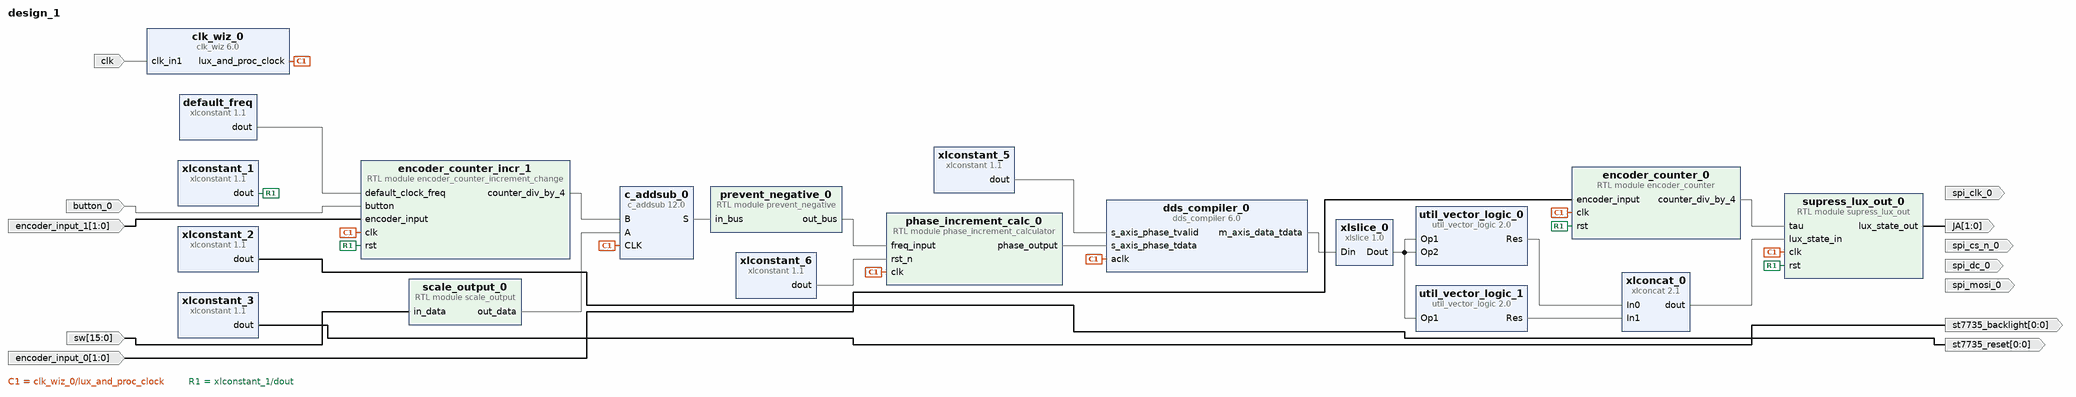
[diagram p0: block diagram of the top level]
# Vivado block design design_1, xc7a35tcpg236-1, Vivado 2023.1
create_bd_design design_1

create_bd_port -dir I -type clk clk
set_property -dict {CONFIG.ASSOCIATED_RESET sw} [get_bd_ports clk]
create_bd_port -dir O -from 1 -to 0 JA
create_bd_port -dir I -from 1 -to 0 encoder_input_0
create_bd_port -dir O -type clk spi_clk_0
create_bd_port -dir O spi_mosi_0
create_bd_port -dir O spi_cs_n_0
create_bd_port -dir O spi_dc_0
create_bd_port -dir O -from 0 -to 0 st7735_backlight
create_bd_port -dir O -from 0 -to 0 st7735_reset
create_bd_port -dir I -from 1 -to 0 encoder_input_1
create_bd_port -dir I button_0
create_bd_port -dir I -from 15 -to 0 sw

create_bd_cell -type ip -vlnv xilinx.com:ip:clk_wiz:6.0 clk_wiz_0
set_property -dict [list \
  CONFIG.CLKIN1_JITTER_PS 100.0 \
  CONFIG.CLKIN2_JITTER_PS 166.66 \
  CONFIG.CLKOUT1_JITTER 114.829 \
  CONFIG.CLKOUT1_PHASE_ERROR 98.575 \
  CONFIG.CLKOUT1_REQUESTED_OUT_FREQ 200 \
  CONFIG.CLKOUT2_JITTER 175.402 \
  CONFIG.CLKOUT2_PHASE_ERROR 98.575 \
  CONFIG.CLKOUT2_REQUESTED_OUT_FREQ 25 \
  CONFIG.CLKOUT2_USED true \
  CONFIG.CLK_OUT1_PORT lux_and_proc_clock \
  CONFIG.CLK_OUT2_PORT spi_hdwr_ckl \
  CONFIG.MMCM_CLKFBOUT_MULT_F 10.000 \
  CONFIG.MMCM_CLKIN1_PERIOD 10.000 \
  CONFIG.MMCM_CLKIN2_PERIOD 10.000 \
  CONFIG.MMCM_CLKOUT0_DIVIDE_F 5.000 \
  CONFIG.MMCM_CLKOUT1_DIVIDE 40 \
  CONFIG.NUM_OUT_CLKS 2 \
  CONFIG.PRIM_IN_FREQ 100 \
  CONFIG.SECONDARY_IN_FREQ 100.000 \
  CONFIG.SECONDARY_SOURCE Single_ended_clock_capable_pin \
  CONFIG.USE_INCLK_SWITCHOVER false \
  CONFIG.USE_LOCKED false \
  CONFIG.USE_RESET false \
] [get_bd_cells clk_wiz_0]
create_bd_cell -type ip -vlnv xilinx.com:ip:xlconstant:1.1 xlconstant_1
set_property -dict {CONFIG.CONST_VAL 0} [get_bd_cells xlconstant_1]
create_bd_cell -type ip -vlnv xilinx.com:ip:xlconstant:1.1 xlconstant_2
set_property -dict {CONFIG.CONST_VAL 0} [get_bd_cells xlconstant_2]
create_bd_cell -type ip -vlnv xilinx.com:ip:xlconstant:1.1 xlconstant_3
create_bd_cell -type ip -vlnv xilinx.com:ip:xlconstant:1.1 default_freq
set_property -dict {CONFIG.CONST_VAL 5000000 CONFIG.CONST_WIDTH 32} [get_bd_cells default_freq]
create_bd_cell -type module -reference encoder_counter encoder_counter_0
create_bd_cell -type ip -vlnv xilinx.com:ip:dds_compiler:6.0 dds_compiler_0
set_property -dict [list \
  CONFIG.DATA_Has_TLAST Not_Required \
  CONFIG.DDS_Clock_Rate 200 \
  CONFIG.Frequency_Resolution 0.4 \
  CONFIG.Has_Phase_Out true \
  CONFIG.Latency 3 \
  CONFIG.M_DATA_Has_TUSER Not_Required \
  CONFIG.Noise_Shaping None \
  CONFIG.Output_Frequency1 0 \
  CONFIG.Output_Selection Sine \
  CONFIG.Output_Width 3 \
  CONFIG.PINC1 0 \
  CONFIG.Parameter_Entry Hardware_Parameters \
  CONFIG.PartsPresent Phase_Generator_and_SIN_COS_LUT \
  CONFIG.Phase_Increment Streaming \
  CONFIG.Phase_Width 32 \
  CONFIG.Resync false \
  CONFIG.S_PHASE_Has_TUSER Not_Required \
] [get_bd_cells dds_compiler_0]
create_bd_cell -type ip -vlnv xilinx.com:ip:xlslice:1.0 xlslice_0
set_property -dict {CONFIG.DIN_FROM 7 CONFIG.DIN_TO 7 CONFIG.DIN_WIDTH 8} [get_bd_cells xlslice_0]
create_bd_cell -type ip -vlnv xilinx.com:ip:xlconcat:2.1 xlconcat_0
create_bd_cell -type module -reference supress_lux_out supress_lux_out_0
create_bd_cell -type ip -vlnv xilinx.com:ip:xlconstant:1.1 xlconstant_5
create_bd_cell -type ip -vlnv xilinx.com:ip:xlconstant:1.1 xlconstant_6
set_property -dict {CONFIG.CONST_VAL 1} [get_bd_cells xlconstant_6]
create_bd_cell -type module -reference phase_increment_calculator phase_increment_calc_0
create_bd_cell -type ip -vlnv xilinx.com:ip:util_vector_logic:2.0 util_vector_logic_0
set_property -dict {CONFIG.C_OPERATION and CONFIG.C_SIZE 1} [get_bd_cells util_vector_logic_0]
create_bd_cell -type ip -vlnv xilinx.com:ip:util_vector_logic:2.0 util_vector_logic_1
set_property -dict {CONFIG.C_OPERATION not CONFIG.C_SIZE 1} [get_bd_cells util_vector_logic_1]
create_bd_cell -type module -reference scale_output scale_output_0
create_bd_cell -type ip -vlnv xilinx.com:ip:c_addsub:12.0 c_addsub_0
set_property -dict [list \
  CONFIG.A_Type Signed \
  CONFIG.A_Width 32 \
  CONFIG.B_Type Signed \
  CONFIG.B_Value 00000000000000000000000000000000 \
  CONFIG.B_Width 32 \
  CONFIG.CE false \
  CONFIG.Latency 1 \
  CONFIG.Out_Width 32 \
] [get_bd_cells c_addsub_0]
create_bd_cell -type module -reference encoder_counter_increment_change encoder_counter_incr_1
create_bd_cell -type module -reference prevent_negative prevent_negative_0

# ---- connections ----

connect_bd_net -net button_0_1 [get_bd_ports button_0] [get_bd_pins encoder_counter_incr_1/button]
connect_bd_net [get_bd_pins c_addsub_0/S] [get_bd_pins prevent_negative_0/in_bus]
connect_bd_net [get_bd_ports clk] [get_bd_pins clk_wiz_0/clk_in1]
connect_bd_net [get_bd_pins clk_wiz_0/lux_and_proc_clock] \
  [get_bd_pins encoder_counter_0/clk] [get_bd_pins dds_compiler_0/aclk] [get_bd_pins supress_lux_out_0/clk] \
  [get_bd_pins phase_increment_calc_0/clk] [get_bd_pins c_addsub_0/CLK] [get_bd_pins encoder_counter_incr_1/clk]
connect_bd_net [get_bd_pins dds_compiler_0/m_axis_data_tdata] [get_bd_pins xlslice_0/Din]
connect_bd_net [get_bd_pins encoder_counter_0/counter_div_by_4] [get_bd_pins supress_lux_out_0/tau]
connect_bd_net [get_bd_pins encoder_counter_incr_1/counter_div_by_4] [get_bd_pins c_addsub_0/B]
connect_bd_net -net encoder_input_0_1 [get_bd_ports encoder_input_0] [get_bd_pins encoder_counter_0/encoder_input]
connect_bd_net -net encoder_input_1_1 [get_bd_ports encoder_input_1] [get_bd_pins encoder_counter_incr_1/encoder_input]
connect_bd_net -net in_data_0_1 [get_bd_ports sw] [get_bd_pins scale_output_0/in_data]
connect_bd_net [get_bd_pins phase_increment_calc_0/phase_output] [get_bd_pins dds_compiler_0/s_axis_phase_tdata]
connect_bd_net [get_bd_pins prevent_negative_0/out_bus] [get_bd_pins phase_increment_calc_0/freq_input]
connect_bd_net [get_bd_pins scale_output_0/out_data] [get_bd_pins c_addsub_0/A]
connect_bd_net [get_bd_pins supress_lux_out_0/lux_state_out] [get_bd_ports JA]
connect_bd_net [get_bd_pins util_vector_logic_0/Res] [get_bd_pins xlconcat_0/In0]
connect_bd_net [get_bd_pins util_vector_logic_1/Res] [get_bd_pins xlconcat_0/In1]
connect_bd_net [get_bd_pins xlconcat_0/dout] [get_bd_pins supress_lux_out_0/lux_state_in]
connect_bd_net -net xlconstant_0_dout [get_bd_pins default_freq/dout] [get_bd_pins encoder_counter_incr_1/default_clock_freq]
connect_bd_net [get_bd_pins xlconstant_1/dout] \
  [get_bd_pins encoder_counter_0/rst] [get_bd_pins supress_lux_out_0/rst] [get_bd_pins encoder_counter_incr_1/rst]
connect_bd_net [get_bd_pins xlconstant_2/dout] [get_bd_ports st7735_reset]
connect_bd_net [get_bd_pins xlconstant_3/dout] [get_bd_ports st7735_backlight]
connect_bd_net [get_bd_pins xlconstant_5/dout] [get_bd_pins dds_compiler_0/s_axis_phase_tvalid]
connect_bd_net [get_bd_pins xlconstant_6/dout] [get_bd_pins phase_increment_calc_0/rst_n]
connect_bd_net [get_bd_pins xlslice_0/Dout] \
  [get_bd_pins util_vector_logic_0/Op2] [get_bd_pins util_vector_logic_0/Op1] [get_bd_pins util_vector_logic_1/Op1]

validate_bd_design
save_bd_design
